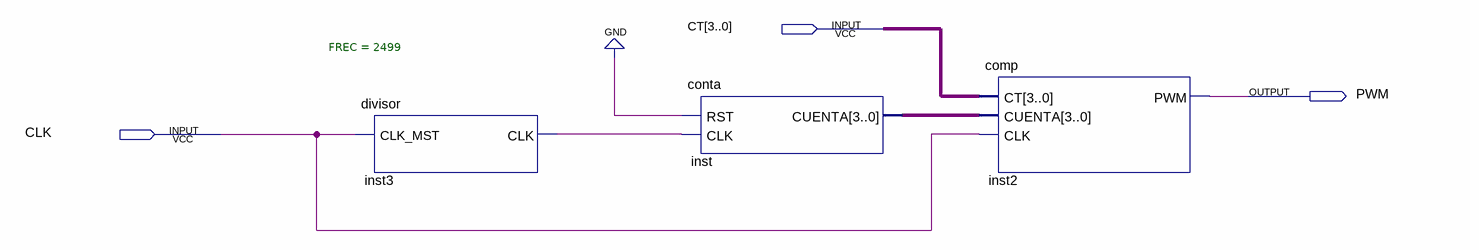
[diagram p0: schematic sheet]
// Quartus schematic pwm_gen.bdf as structural Verilog: 3 symbols, 3 pins
module pwm_gen (
  input  [3:0] CT,
  input  CLK,
  output PWM
);

  wire inst3_clk;
  wire [3:0] inst_cuenta;

  divisor #(.FREC(2499)) inst3 (.CLK_MST(CLK), .CLK(inst3_clk));
  conta inst (.RST(1'b0), .CLK(inst3_clk), .CUENTA(inst_cuenta));
  comp inst2 (.CT(CT), .CUENTA(inst_cuenta), .CLK(CLK), .PWM(PWM));
endmodule
